# Altium schematic sheet clock.SchDoc
size A4
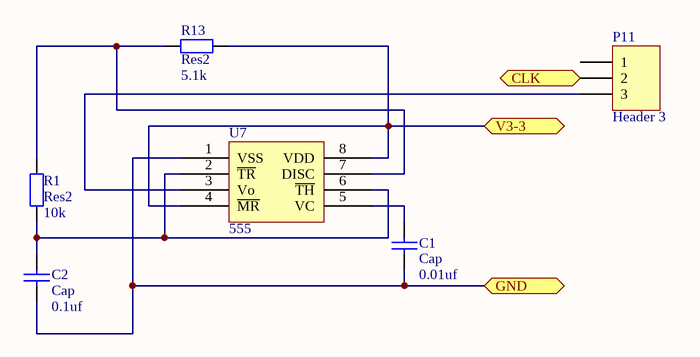
[diagram p0: clock.SchDoc]

## Parts
C1  Cap  value 0.01uf  [0603]
C2  Cap  value 0.1uf  [0603]
P11  Header 3  [HDR1X3]
R1  Res2  value 10k  [0603]
R13  Res2  value 5.1k  [0603]
U7  555  [SOP-8]

## Ports
CLK, GND, V3-3

## Nets
CLK: P11.2 ; port CLK
GND: C1.1 C2.1 U7.1(VSS) ; port GND
V3-3: R13.1 U7.4(~{MR}) U7.8(VDD) ; port V3-3
NetC1_2: C1.2 U7.5(VC)
NetC2_2: C2.2 R1.1 U7.2(~{TR}) U7.6(~{TH})
NetP11_3: P11.3 U7.3(Vo)
NetR1_2: R1.2 R13.2 U7.7(DISC)

Not connected (* = marked no-connect by the designer): P11 1

## Library data of the parts
C1 C2 = Cap: Capacitor; Published: 8-Jun-2000; LatestRevisionDate: 17-Jul-2002; LatestRevisionNote: Re-released for DXP Platform.; PackageReference: RAD-0.3; Publisher: Altium Limited; PackageDescription: Radial Cap, Thru-Hole; 2 Leads; 0.3 in Pin Spacing
P11 = Header 3: Header, 3-Pin; LatestRevisionDate: 17-Jul-2002; LatestRevisionNote: Re-released for DXP Platform.; Publisher: Altium Limited
R1 R13 = Res2: Resistor; Published: 8-Jun-2000; LatestRevisionDate: 17-Jul-2002; LatestRevisionNote: Re-released for DXP Platform.; PackageReference: AXIAL-0.4; Publisher: Altium Limited; PackageDescription: Axial Device, Thru-Hole; 2 Leads; 0.4 in Pin Spacing
U7 = NE555